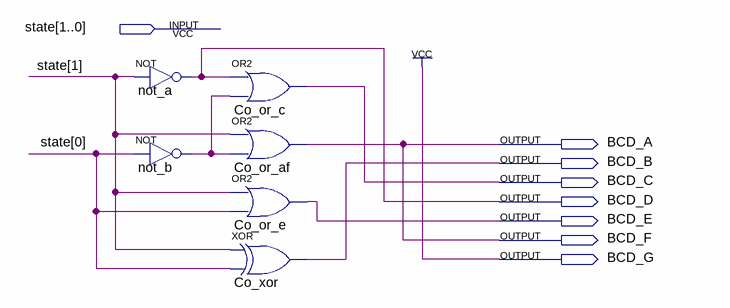
[diagram p0: schematic sheet]
// Quartus schematic opt_bcd_states.bdf as structural Verilog: 6 symbols, 8 pins
module opt_bcd_states (
  input  [1:0] state,
  output BCD_A,
  output BCD_B,
  output BCD_C,
  output BCD_D,
  output BCD_E,
  output BCD_F,
  output BCD_G
);

  wire not_b_out;

  not not_a (BCD_D, state[1]);
  not not_b (not_b_out, state[0]);
  or Co_or_c (BCD_C, BCD_D, not_b_out);
  or Co_or_af (BCD_A, state[1], not_b_out);
  or Co_or_e (BCD_E, state[1], state[0]);
  xor Co_xor (BCD_B, state[1], state[0]);

  assign BCD_F = BCD_A;
  assign BCD_G = 1'b1;
endmodule
